# Altium project A3000_16MB.PrjPcb (part 2 of 2)
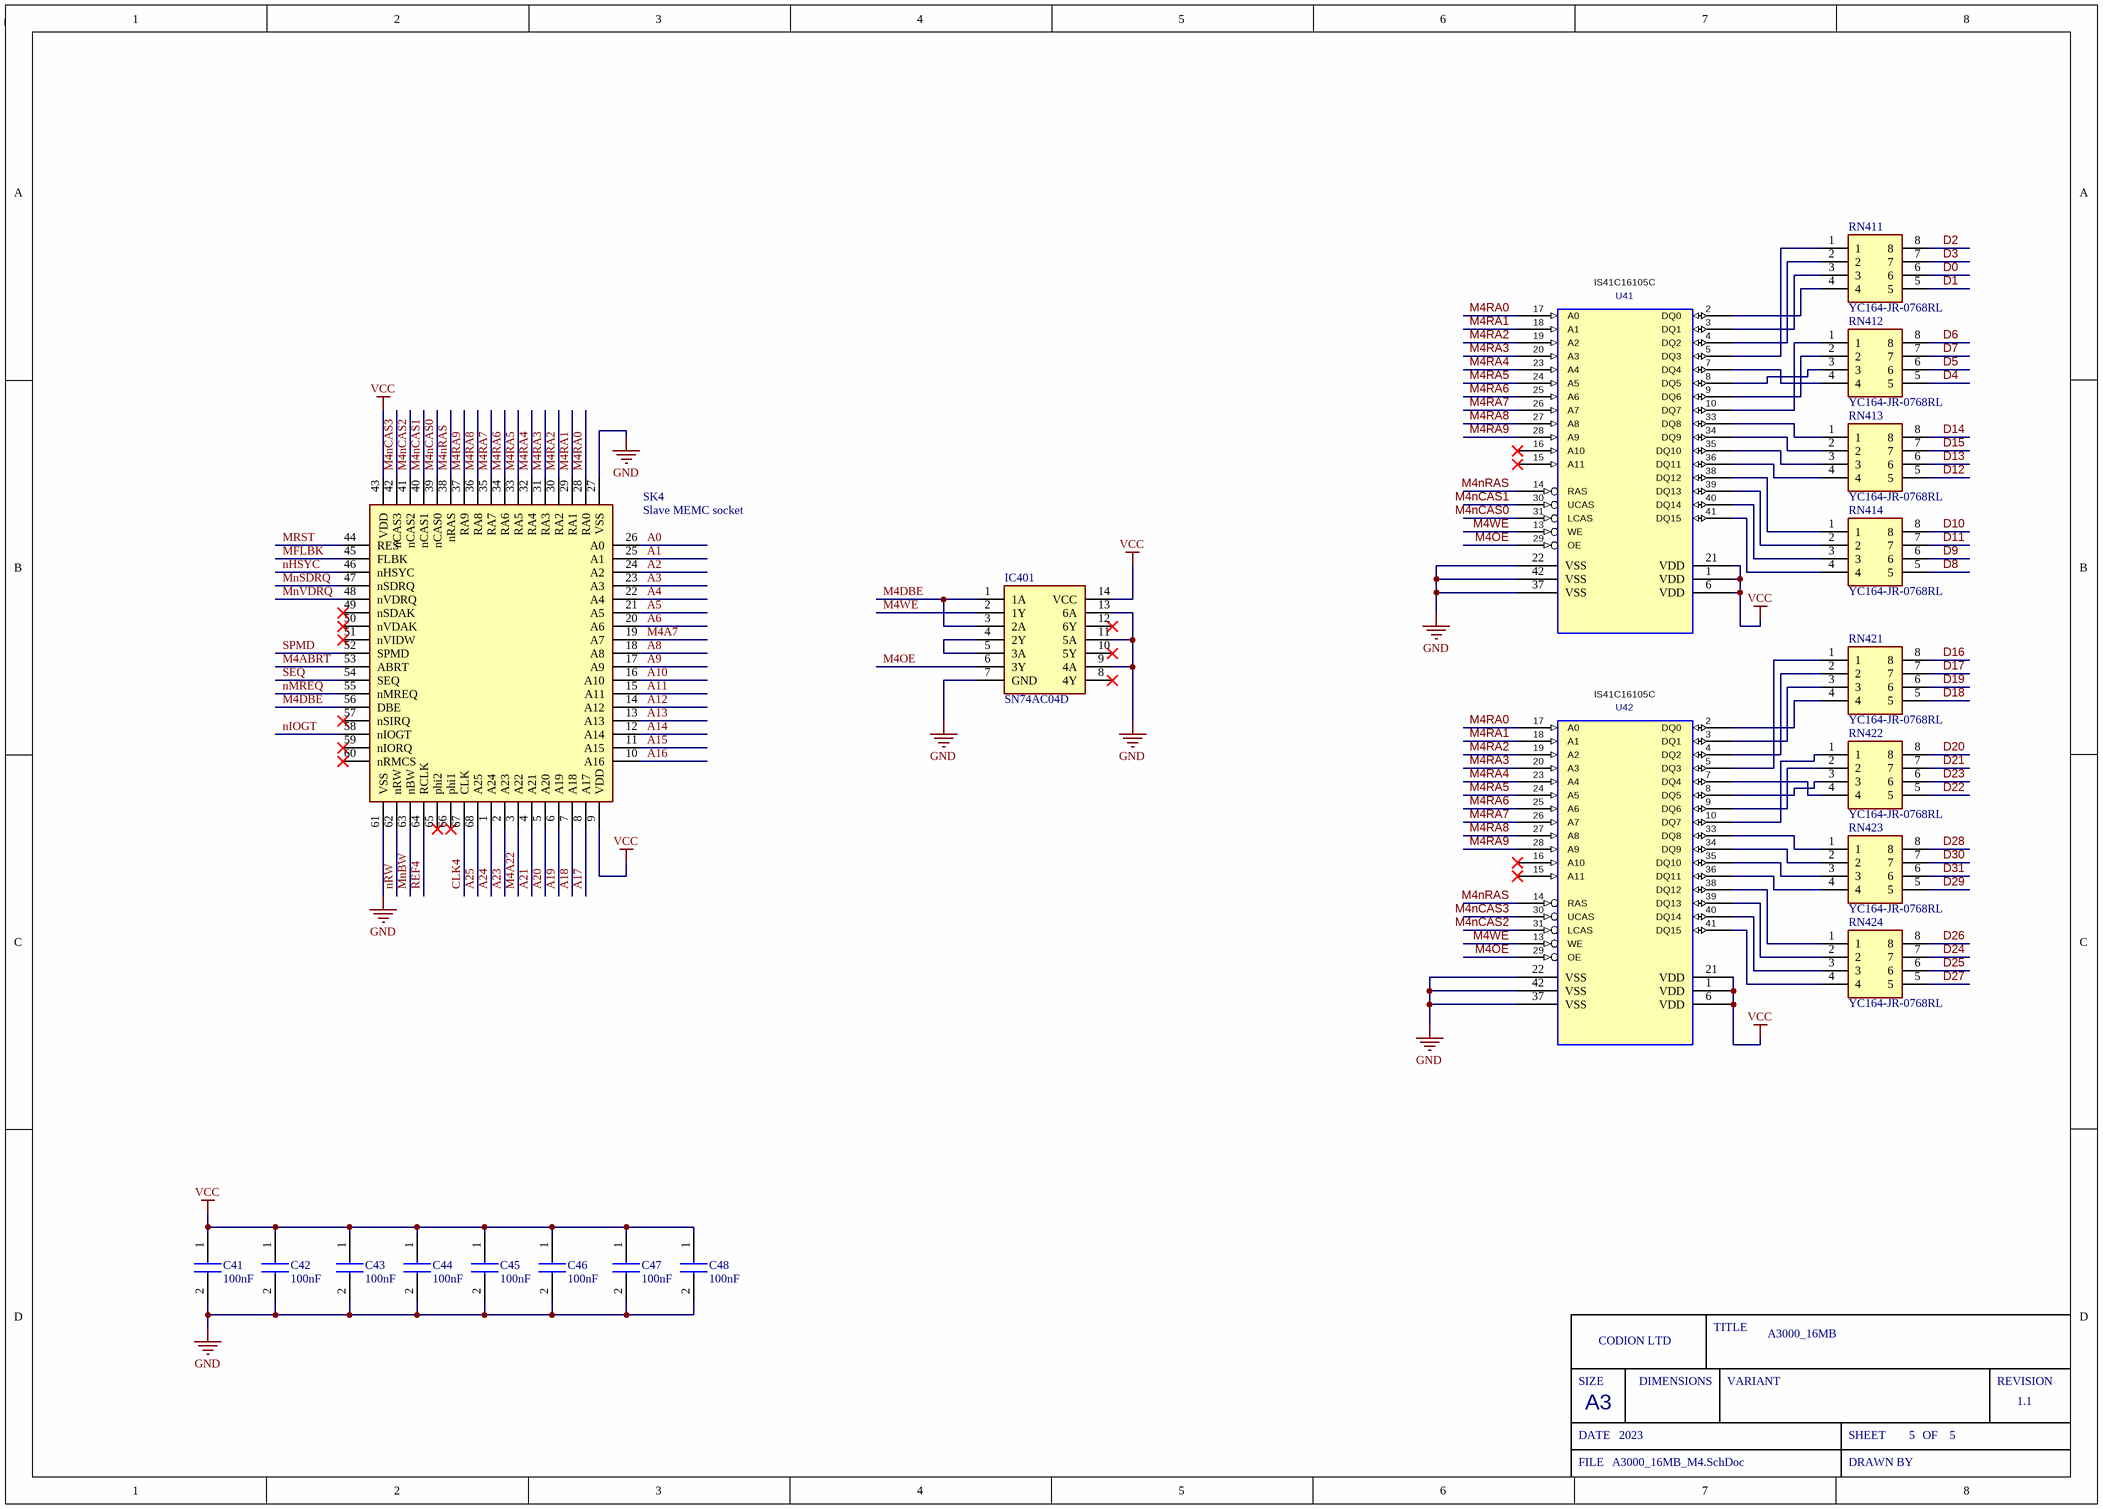
[diagram p5: A3000_16MB_M4.SchDoc]

## Nets that join several sheets
GND: A3000_16MB_Glue (12 pins), A3000_16MB (35 pins), A3000_16MB_M2 (20 pins), A3000_16MB_M3 (20 pins), A3000_16MB_M4 (20 pins)
VCC: A3000_16MB_Glue (48 pins), A3000_16MB (34 pins), A3000_16MB_M2 (17 pins), A3000_16MB_M3 (17 pins), A3000_16MB_M4 (17 pins)
A0: A3000_16MB (PL1.26 SK1.26), A3000_16MB_M2 (SK2.26), A3000_16MB_M3 (SK3.26), A3000_16MB_M4 (SK4.26)
A1: A3000_16MB (PL1.25 SK1.25), A3000_16MB_M2 (SK2.25), A3000_16MB_M3 (SK3.25), A3000_16MB_M4 (SK4.25)
A2: A3000_16MB (PL1.24 SK1.24), A3000_16MB_M2 (SK2.24), A3000_16MB_M3 (SK3.24), A3000_16MB_M4 (SK4.24)
A3: A3000_16MB (PL1.23 SK1.23), A3000_16MB_M2 (SK2.23), A3000_16MB_M3 (SK3.23), A3000_16MB_M4 (SK4.23)
A4: A3000_16MB (PL1.22 SK1.22), A3000_16MB_M2 (SK2.22), A3000_16MB_M3 (SK3.22), A3000_16MB_M4 (SK4.22)
A5: A3000_16MB (PL1.21 SK1.21), A3000_16MB_M2 (SK2.21), A3000_16MB_M3 (SK3.21), A3000_16MB_M4 (SK4.21)
A6: A3000_16MB (PL1.20 SK1.20), A3000_16MB_M2 (SK2.20), A3000_16MB_M3 (SK3.20), A3000_16MB_M4 (SK4.20)
A7: A3000_16MB_Glue (IC39.8), A3000_16MB (PL1.19)
A8: A3000_16MB (PL1.18 SK1.18), A3000_16MB_M2 (SK2.18), A3000_16MB_M3 (SK3.18), A3000_16MB_M4 (SK4.18)
A9: A3000_16MB (PL1.17 SK1.17), A3000_16MB_M2 (SK2.17), A3000_16MB_M3 (SK3.17), A3000_16MB_M4 (SK4.17)
A10: A3000_16MB (PL1.16 SK1.16), A3000_16MB_M2 (SK2.16), A3000_16MB_M3 (SK3.16), A3000_16MB_M4 (SK4.16)
A11: A3000_16MB (PL1.15 SK1.15), A3000_16MB_M2 (SK2.15), A3000_16MB_M3 (SK3.15), A3000_16MB_M4 (SK4.15)
A12: A3000_16MB_Glue (IC39.7), A3000_16MB (PL1.14 SK1.14), A3000_16MB_M2 (SK2.14), A3000_16MB_M3 (SK3.14), A3000_16MB_M4 (SK4.14)
A13: A3000_16MB_Glue (IC39.6), A3000_16MB (PL1.13 SK1.13), A3000_16MB_M2 (SK2.13), A3000_16MB_M3 (SK3.13), A3000_16MB_M4 (SK4.13)
A14: A3000_16MB_Glue (IC39.5), A3000_16MB (PL1.12 SK1.12), A3000_16MB_M2 (SK2.12), A3000_16MB_M3 (SK3.12), A3000_16MB_M4 (SK4.12)
A15: A3000_16MB (PL1.11 SK1.11), A3000_16MB_M2 (SK2.11), A3000_16MB_M3 (SK3.11), A3000_16MB_M4 (SK4.11)
A16: A3000_16MB (PL1.10 SK1.10), A3000_16MB_M2 (SK2.10), A3000_16MB_M3 (SK3.10), A3000_16MB_M4 (SK4.10)
A17: A3000_16MB (PL1.8 SK1.8), A3000_16MB_M2 (SK2.8), A3000_16MB_M3 (SK3.8), A3000_16MB_M4 (SK4.8)
A18: A3000_16MB (PL1.7 SK1.7), A3000_16MB_M2 (SK2.7), A3000_16MB_M3 (SK3.7), A3000_16MB_M4 (SK4.7)
A19: A3000_16MB (PL1.6 SK1.6), A3000_16MB_M2 (SK2.6), A3000_16MB_M3 (SK3.6), A3000_16MB_M4 (SK4.6)
A20: A3000_16MB (PL1.5 SK1.5), A3000_16MB_M2 (SK2.5), A3000_16MB_M3 (SK3.5), A3000_16MB_M4 (SK4.5)
A21: A3000_16MB (PL1.4 SK1.4), A3000_16MB_M2 (SK2.4), A3000_16MB_M3 (SK3.4), A3000_16MB_M4 (SK4.4)
A22: A3000_16MB_Glue (IC39.4), A3000_16MB (PL1.3)
A23: A3000_16MB_Glue (IC39.3), A3000_16MB (PL1.2 SK1.2), A3000_16MB_M2 (SK2.2), A3000_16MB_M3 (SK3.2), A3000_16MB_M4 (SK4.2)
A24: A3000_16MB_Glue (IC39.2), A3000_16MB (PL1.1 SK1.1), A3000_16MB_M2 (SK2.1), A3000_16MB_M3 (SK3.1), A3000_16MB_M4 (SK4.1)
A25: A3000_16MB_Glue (IC39.1), A3000_16MB (PL1.68 SK1.68), A3000_16MB_M2 (SK2.68), A3000_16MB_M3 (SK3.68), A3000_16MB_M4 (SK4.68)
ABRT: A3000_16MB_Glue (IC56.6), A3000_16MB (PL1.53)
CLK: A3000_16MB_Glue (5 pins), A3000_16MB (PL1.67)
CLK1: A3000_16MB_Glue (R519.1), A3000_16MB (SK1.67)
CLK2: A3000_16MB_Glue (R520.1), A3000_16MB_M2 (SK2.67)
CLK3: A3000_16MB_Glue (R521.2), A3000_16MB_M3 (SK3.67)
CLK4: A3000_16MB_Glue (R522.2), A3000_16MB_M4 (SK4.67)
D0: A3000_16MB (J1.3 RN111.6), A3000_16MB_M2 (RN211.5), A3000_16MB_M3 (RN311.6), A3000_16MB_M4 (RN411.6)
D1: A3000_16MB (J1.2 RN111.5), A3000_16MB_M2 (RN211.6), A3000_16MB_M3 (RN311.5), A3000_16MB_M4 (RN411.5)
D2: A3000_16MB (J1.19 RN111.8), A3000_16MB_M2 (RN211.8), A3000_16MB_M3 (RN311.8), A3000_16MB_M4 (RN411.8)
D3: A3000_16MB (J1.17 RN111.7), A3000_16MB_M2 (RN211.7), A3000_16MB_M3 (RN311.7), A3000_16MB_M4 (RN411.7)
D4: A3000_16MB (J1.20 RN112.5), A3000_16MB_M2 (RN212.5), A3000_16MB_M3 (RN312.5), A3000_16MB_M4 (RN412.5)
D5: A3000_16MB (J2.1 RN112.6), A3000_16MB_M2 (RN212.6), A3000_16MB_M3 (RN312.6), A3000_16MB_M4 (RN412.6)
D6: A3000_16MB (J2.3 RN112.8), A3000_16MB_M2 (RN212.8), A3000_16MB_M3 (RN312.8), A3000_16MB_M4 (RN412.8)
D7: A3000_16MB (J2.2 RN112.7), A3000_16MB_M2 (RN212.7), A3000_16MB_M3 (RN312.7), A3000_16MB_M4 (RN412.7)
D8: A3000_16MB (J2.5 RN114.5), A3000_16MB_M2 (RN214.5), A3000_16MB_M3 (RN314.5), A3000_16MB_M4 (RN414.5)
D9: A3000_16MB (J2.6 RN114.6), A3000_16MB_M2 (RN214.6), A3000_16MB_M3 (RN314.6), A3000_16MB_M4 (RN414.6)
D10: A3000_16MB (J2.8 RN114.8), A3000_16MB_M2 (RN214.8), A3000_16MB_M3 (RN314.8), A3000_16MB_M4 (RN414.8)
D11: A3000_16MB (J2.7 RN114.7), A3000_16MB_M2 (RN214.7), A3000_16MB_M3 (RN314.7), A3000_16MB_M4 (RN414.7)
D12: A3000_16MB (J2.9 RN113.5), A3000_16MB_M2 (RN213.5), A3000_16MB_M3 (RN313.5), A3000_16MB_M4 (RN413.5)
D13: A3000_16MB (J2.10 RN113.6), A3000_16MB_M2 (RN213.6), A3000_16MB_M3 (RN313.6), A3000_16MB_M4 (RN413.6)
D14: A3000_16MB (J2.12 RN113.8), A3000_16MB_M2 (RN213.8), A3000_16MB_M3 (RN313.8), A3000_16MB_M4 (RN413.8)
D15: A3000_16MB (J2.11 RN113.7), A3000_16MB_M2 (RN213.7), A3000_16MB_M3 (RN313.7), A3000_16MB_M4 (RN413.7)
D16: A3000_16MB (J2.15 RN121.5), A3000_16MB_M2 (RN221.5), A3000_16MB_M3 (RN321.5), A3000_16MB_M4 (RN421.8)
D17: A3000_16MB (J2.17 RN121.6), A3000_16MB_M2 (RN221.6), A3000_16MB_M3 (RN321.6), A3000_16MB_M4 (RN421.7)
D18: A3000_16MB (J2.19 RN121.8), A3000_16MB_M2 (RN221.8), A3000_16MB_M3 (RN321.8), A3000_16MB_M4 (RN421.5)
D19: A3000_16MB (J2.18 RN121.7), A3000_16MB_M2 (RN221.7), A3000_16MB_M3 (RN321.7), A3000_16MB_M4 (RN421.6)
D20: A3000_16MB (J3.1 RN122.5), A3000_16MB_M2 (RN222.8), A3000_16MB_M3 (RN322.5), A3000_16MB_M4 (RN422.8)
D21: A3000_16MB (J3.3 RN122.6), A3000_16MB_M2 (RN222.7), A3000_16MB_M3 (RN322.6), A3000_16MB_M4 (RN422.7)
D22: A3000_16MB (J3.15 RN122.8), A3000_16MB_M2 (RN222.5), A3000_16MB_M3 (RN322.8), A3000_16MB_M4 (RN422.5)
D23: A3000_16MB (J3.5 RN122.7), A3000_16MB_M2 (RN222.6), A3000_16MB_M3 (RN322.7), A3000_16MB_M4 (RN422.6)
D24: A3000_16MB (J3.12 RN124.7), A3000_16MB_M2 (RN224.7), A3000_16MB_M3 (RN324.6), A3000_16MB_M4 (RN424.7)
D25: A3000_16MB (J3.11 RN124.6), A3000_16MB_M2 (RN224.6), A3000_16MB_M3 (RN324.5), A3000_16MB_M4 (RN424.6)
D26: A3000_16MB (J3.13 RN124.8), A3000_16MB_M2 (RN224.8), A3000_16MB_M3 (RN324.7), A3000_16MB_M4 (RN424.8)
D27: A3000_16MB (J1.15 RN124.5), A3000_16MB_M2 (RN224.5), A3000_16MB_M3 (RN324.8), A3000_16MB_M4 (RN424.5)
D28: A3000_16MB (J3.18 RN123.7), A3000_16MB_M2 (RN223.7), A3000_16MB_M3 (RN323.6), A3000_16MB_M4 (RN423.8)
D29: A3000_16MB (J3.16 RN123.5), A3000_16MB_M2 (RN223.5), A3000_16MB_M3 (RN323.8), A3000_16MB_M4 (RN423.5)
D30: A3000_16MB (J3.17 RN123.6), A3000_16MB_M2 (RN223.8), A3000_16MB_M3 (RN323.7), A3000_16MB_M4 (RN423.7)
D31: A3000_16MB (J3.19 RN123.8), A3000_16MB_M2 (RN223.6), A3000_16MB_M3 (RN323.5), A3000_16MB_M4 (RN423.6)
FLBK: A3000_16MB_Glue (IC4.6), A3000_16MB (PL1.45)
M1A7: A3000_16MB_Glue (IC39.15 R505.1), A3000_16MB (SK1.19)
M1A22: A3000_16MB_Glue (IC39.19 R501.1), A3000_16MB (SK1.3)
M1ABRT: A3000_16MB_Glue (IC56.1), A3000_16MB (SK1.53)
M2A7: A3000_16MB_Glue (IC39.14 R506.1), A3000_16MB_M2 (SK2.19)
M2A22: A3000_16MB_Glue (IC39.18 R502.1), A3000_16MB_M2 (SK2.3)
M2ABRT: A3000_16MB_Glue (IC56.2 R532.1), A3000_16MB_M2 (SK2.53)
M3A7: A3000_16MB_Glue (IC39.13 R507.1), A3000_16MB_M3 (SK3.19)
M3A22: A3000_16MB_Glue (IC39.17 R503.1), A3000_16MB_M3 (SK3.3)
M3ABRT: A3000_16MB_Glue (IC56.4 R531.1), A3000_16MB_M3 (SK3.53)
M4A7: A3000_16MB_Glue (IC39.12 R508.1), A3000_16MB_M4 (SK4.19)
M4A22: A3000_16MB_Glue (IC39.16 R504.1), A3000_16MB_M4 (SK4.3)
M4ABRT: A3000_16MB_Glue (IC56.5 R530.1), A3000_16MB_M4 (SK4.53)
MFLBK: A3000_16MB_Glue (IC4.7), A3000_16MB (SK1.45), A3000_16MB_M2 (SK2.45), A3000_16MB_M3 (SK3.45), A3000_16MB_M4 (SK4.45)
MnBW: A3000_16MB_Glue (R514.1), A3000_16MB_M2 (SK2.63), A3000_16MB_M3 (SK3.63), A3000_16MB_M4 (SK4.63)
MnSDRQ: A3000_16MB_Glue (IC4.5), A3000_16MB (SK1.47), A3000_16MB_M2 (SK2.47), A3000_16MB_M3 (SK3.47), A3000_16MB_M4 (SK4.47)
MnVDRQ: A3000_16MB_Glue (IC4.2), A3000_16MB (SK1.48), A3000_16MB_M2 (SK2.48), A3000_16MB_M3 (SK3.48), A3000_16MB_M4 (SK4.48)
MRST: A3000_16MB_Glue (IC4.12 IC52.1), A3000_16MB (R551.2 SK1.44), A3000_16MB_M2 (SK2.44), A3000_16MB_M3 (SK3.44), A3000_16MB_M4 (SK4.44)
nBW: A3000_16MB_Glue (IC53.5), A3000_16MB (PL1.63 SK1.63)
nHSYC: A3000_16MB (PL1.46 SK1.46), A3000_16MB_M2 (SK2.46), A3000_16MB_M3 (SK3.46), A3000_16MB_M4 (SK4.46)
nIOGT: A3000_16MB (PL1.58 SK1.58), A3000_16MB_M2 (SK2.58), A3000_16MB_M3 (SK3.58), A3000_16MB_M4 (SK4.58)
nMREQ: A3000_16MB (PL1.55 SK1.55), A3000_16MB_M2 (SK2.55), A3000_16MB_M3 (SK3.55), A3000_16MB_M4 (SK4.55)
nRW: A3000_16MB_Glue (IC39.9), A3000_16MB (PL1.62 SK1.62), A3000_16MB_M2 (SK2.62), A3000_16MB_M3 (SK3.62), A3000_16MB_M4 (SK4.62)
nSDRQ: A3000_16MB_Glue (IC4.4), A3000_16MB (PL1.47)
nVDRQ: A3000_16MB_Glue (IC4.3), A3000_16MB (PL1.48)
RCLK: A3000_16MB_Glue (R523.2), A3000_16MB (PL1.64 SK1.64)
REF2: A3000_16MB_Glue (IC71.3 R510.1), A3000_16MB_M2 (SK2.64)
REF3: A3000_16MB_Glue (IC71.4 R511.1), A3000_16MB_M3 (SK3.64)
REF4: A3000_16MB_Glue (IC71.5 R512.1), A3000_16MB_M4 (SK4.64)
SEQ: A3000_16MB (PL1.54 SK1.54), A3000_16MB_M2 (SK2.54), A3000_16MB_M3 (SK3.54), A3000_16MB_M4 (SK4.54)
SPMD: A3000_16MB (PL1.52 SK1.52), A3000_16MB_M2 (SK2.52), A3000_16MB_M3 (SK3.52), A3000_16MB_M4 (SK4.52)

## Assembly variants
JLCPCB_Assy: not fitted C7 C8 C13 C101 IC4 IC39 IC56 IC71 J1 J2 J3 PL1 RST_IN SK1 SK2 SK3 SK4 U1 U2 U21 U22 U31 U32 U41 U42